# EAGLE schematic PICqueno32_DIP.v1 (EAGLE 5.11)
PROJECT: PICqueño32 DIP v1.0
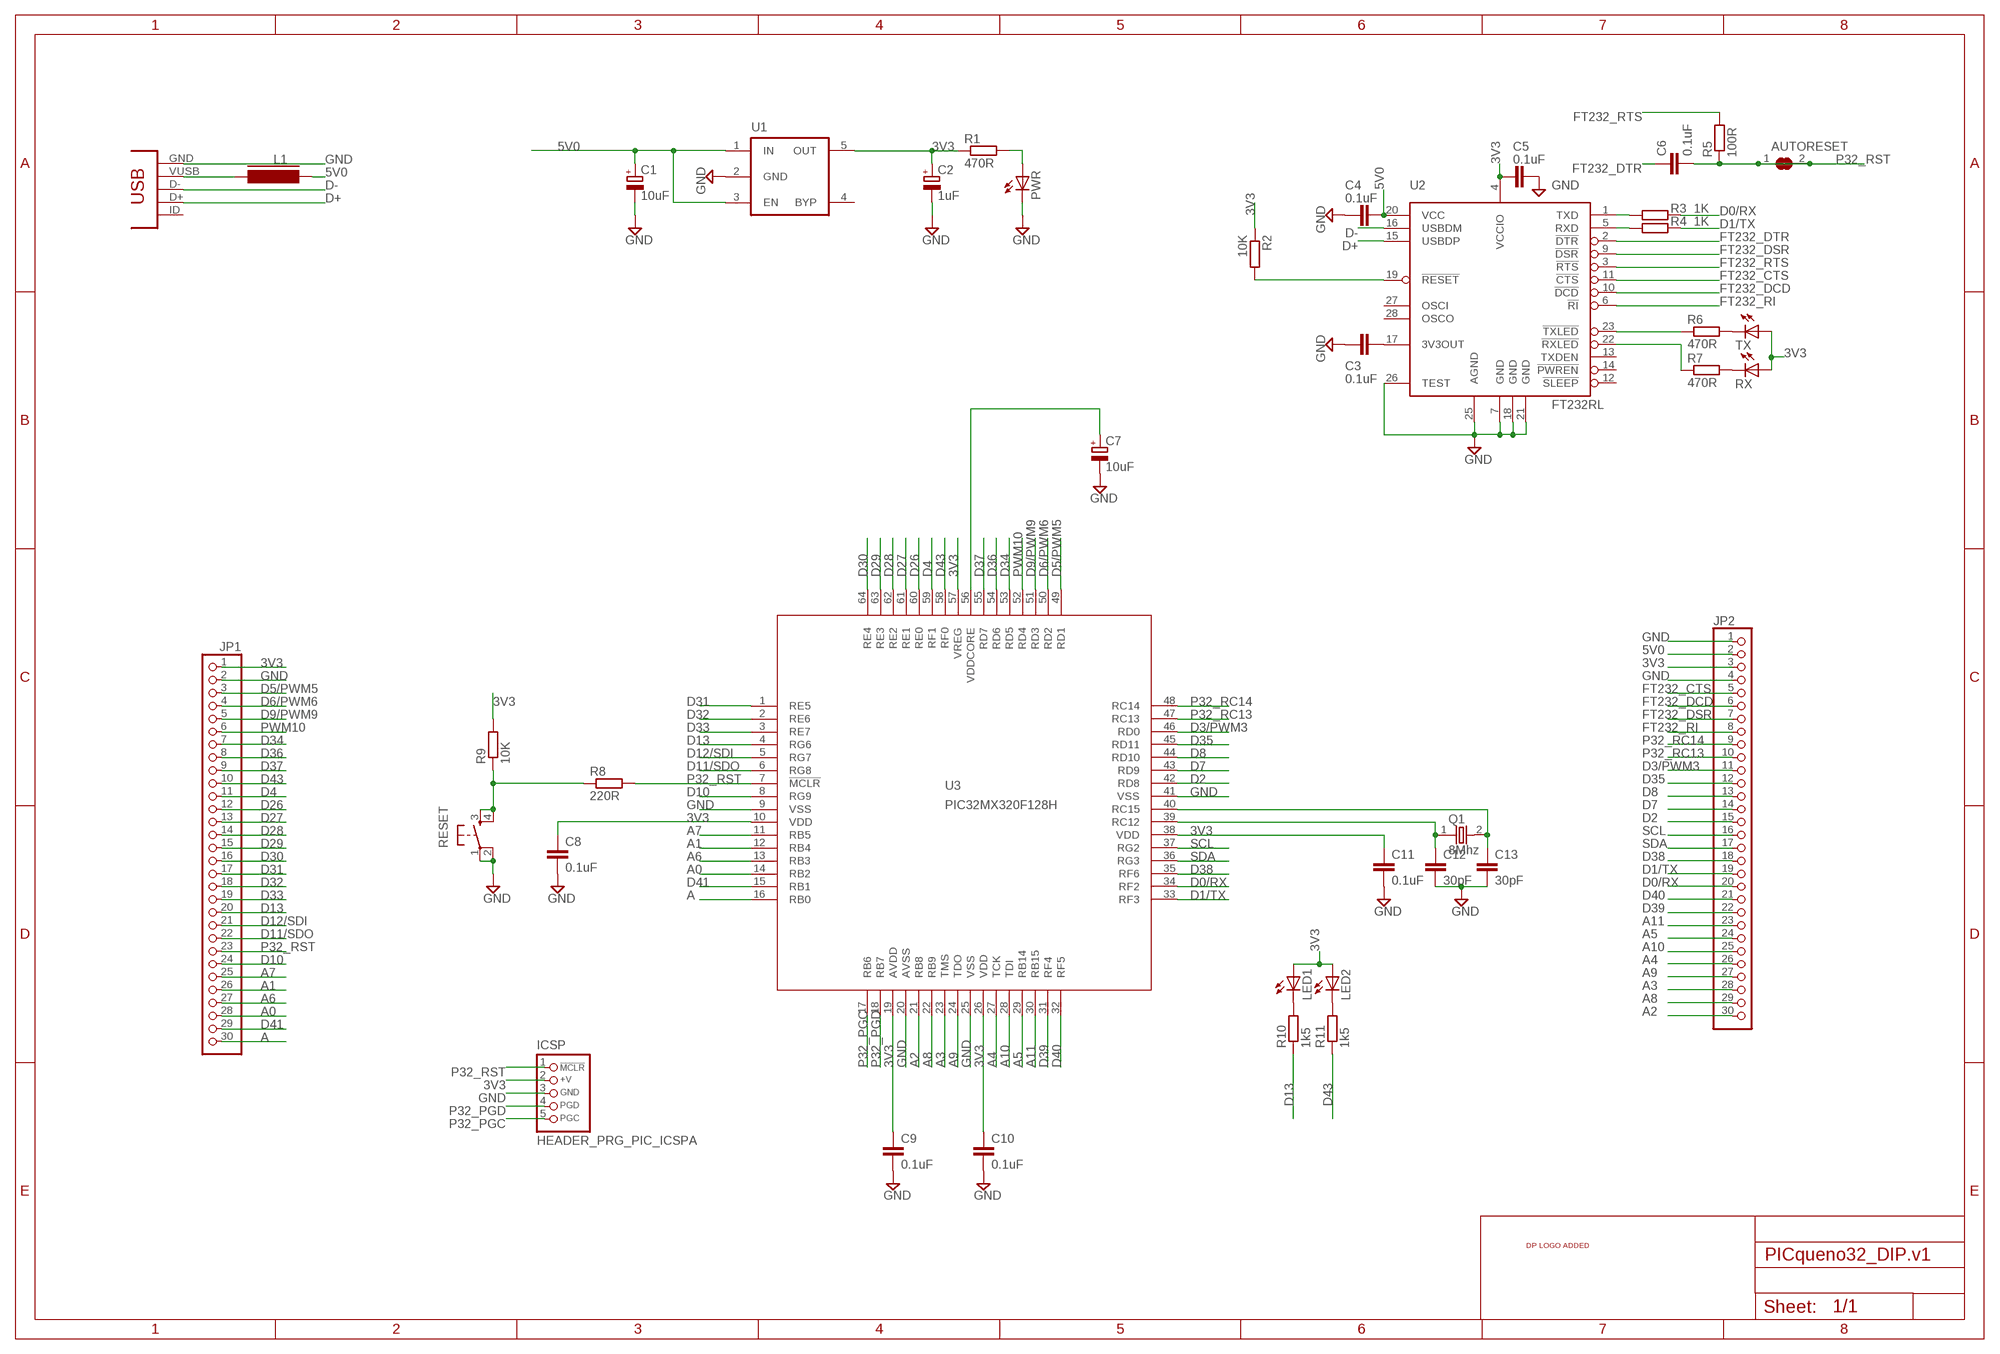
[diagram p0: schematic, sheet 1]

## Parts
AUTORESET  SJ  [SJ]
C1  10uF  CAP_POLSMC_A  [SMC_A]
C2  1uF  CAP_POLSMC_A  [SMC_A]
C3  0.1uF  CAPC603  [C603]
C4  0.1uF  CAPC603  [C603]
C5  0.1uF  CAPC603  [C603]
C6  0.1uF  CAPC603  [C603]
C7  10uF  CAP_POLSMC_A  [SMC_A]
C8  0.1uF  CAPC603  [C603]
C9  0.1uF  CAPC603  [C603]
C10  0.1uF  CAPC603  [C603]
C11  0.1uF  CAPC603  [C603]
C12  30pF  CAPC603  [C603]
C13  30pF  CAPC603  [C603]
ICSP  HEADER_PRG_PIC_ICSPA  [HEADER_PRG_1X05]
JP1  PINHD-1X30  [1X30]
JP2  PINHD-1X30  [1X30]
L1  FERRITE_BEAD603  [FB603]
LED1  LED805  [LED-805]
LED2  LED805  [LED-805]
PWR  LED805  [LED-805]
Q1  8Mhz  OSC-XTAL  [HC-49U]
R1  470R  RESISTORR603  [R603]
R2  10K  RESISTORR603  [R603]
R3  1K  RESISTORR603  [R603]
R4  1K  RESISTORR603  [R603]
R5  100R  RESISTORR603  [R603]
R6  470R  RESISTORR603  [R603]
R7  470R  RESISTORR603  [R603]
R8  220R  RESISTORR603  [R603]
R9  10K  RESISTORR603  [R603]
R10  1k5  RESISTORR603  [R603]
R11  1k5  RESISTORR603  [R603]
RESET  SW-SMD-SMALL  [TACT_SWITCH_SMALL]
RX  LED805  [LED-805]
TX  LED805  [LED-805]
U1  MIC5205  [SOT-23-5]
U2  FT232RL  [SSOP28]
U3  PIC32MX320F128H  PIC32MX320F064H  [TQFP64-10X10]
U$1  DP_LOGO  [DP_LOGO]
USB1  CON-USB-MINI-BUSB1  [CONN_USB_MINI-B]

## Nets
3V3: C2.+ C5.1 C8.1 C9.1 C10.1 C11.1 ICSP.2(+V) JP1.1 JP2.3 LED1.A LED2.A R1.1 R2.1 R9.2 RX.A TX.A U1.5(OUT) U2.4(VCCIO) U3.10(VDD) U3.19(AVDD) U3.26(VDD) U3.38(VDD) U3.57(VREG)
5V0: C1.+ C4.1 JP2.2 L1.1 U1.1(IN) U1.3(EN) U2.20(VCC)
A: JP1.30 U3.16(RB0)
A0: JP1.28 U3.14(RB2)
A1: JP1.26 U3.12(RB4)
A2: JP2.30 U3.21(RB8)
A3: JP2.28 U3.23(TMS)
A4: JP2.26 U3.27(TCK)
A5: JP2.24 U3.29(RB14)
A6: JP1.27 U3.13(RB3)
A7: JP1.25 U3.11(RB5)
A8: JP2.29 U3.22(RB9)
A9: JP2.27 U3.24(TDO)
A10: JP2.25 U3.28(TDI)
A11: JP2.23 U3.30(RB15)
D0/RX: JP2.20 R3.2 U3.34(RF2)
D1/TX: JP2.19 R4.2 U3.33(RF3)
D2: JP2.15 U3.42(RD8)
D3/PWM3: JP2.11 U3.46(RD0)
D4: JP1.11 U3.59(RF1)
D5/PWM5: JP1.3 U3.49(RD1)
D6/PWM6: JP1.4 U3.50(RD2)
D7: JP2.14 U3.43(RD9)
D8: JP2.13 U3.44(RD10)
D9/PWM9: JP1.5 U3.51(RD3)
D10: JP1.24 U3.8(RG9)
D11/SDO: JP1.22 U3.6(RG8)
D12/SDI: JP1.21 U3.5(RG7)
D13: JP1.20 R10.1 U3.4(RG6)
D26: JP1.12 U3.60(RE0)
D27: JP1.13 U3.61(RE1)
D28: JP1.14 U3.62(RE2)
D29: JP1.15 U3.63(RE3)
D30: JP1.16 U3.64(RE4)
D31: JP1.17 U3.1(RE5)
D32: JP1.18 U3.2(RE6)
D33: JP1.19 U3.3(RE7)
D34: JP1.7 U3.53(RD5)
D35: JP2.12 U3.45(RD11)
D36: JP1.8 U3.54(RD6)
D37: JP1.9 U3.55(RD7)
D38: JP2.18 U3.35(RF6)
D39: JP2.22 U3.31(RF4)
D40: JP2.21 U3.32(RF5)
D41: JP1.29 U3.15(RB1)
D43: JP1.10 R11.1 U3.58(RF0)
D+: U2.15(USBDP) USB1.D+
D-: U2.16(USBDM) USB1.D-
FT232_CTS: JP2.5 U2.11(!CTS)
FT232_DCD: JP2.6 U2.10(!DCD)
FT232_DSR: JP2.7 U2.9(!DSR)
FT232_DTR: C6.1 U2.2(!DTR)
FT232_RI: JP2.8 U2.6(!RI)
FT232_RTS: R5.2 U2.3(!RTS)
GND: C1.- C2.- C3.2 C4.2 C5.2 C7.- C8.2 C9.2 C10.2 C11.2 C12.2 C13.2 ICSP.3(GND) JP1.2 JP2.1 JP2.4 PWR.C RESET.1 RESET.2 U1.2(GND) U2.7(GND) U2.18(GND) U2.21(GND) U2.25(AGND) U2.26(TEST) U3.9(VSS) U3.20(AVSS) U3.25(VSS) U3.41(VSS) USB1.GND
N$1: C3.1 U2.17(3V3OUT)
N$2: R2.2 U2.19(!RESET)
N$3: R3.1 U2.1(TXD)
N$4: R4.1 U2.5(RXD)
N$5: C7.+ U3.56(VDDCORE)
N$6: R6.2 TX.C
N$8: LED1.C R10.2
N$9: LED2.C R11.2
N$11: R7.2 RX.C
N$12: R6.1 U2.23(!TXLED)
N$15: PWR.A R1.2
N$16: R8.1 R9.1 RESET.3 RESET.4
N$19: C12.1 Q1.1 U3.39(RC12)
N$20: C13.1 Q1.2 U3.40(RC15)
N$32: R7.1 U2.22(!RXLED)
P32_PGC: ICSP.5(PGC) U3.17(RB6)
P32_PGD: ICSP.4(PGD) U3.18(RB7)
P32_RC13: JP2.10 U3.47(RC13)
P32_RC14: JP2.9 U3.48(RC14)
P32_RST: AUTORESET.1 AUTORESET.2 C6.2 ICSP.1(/MCLR) JP1.23 R5.1 R8.2 U3.7(!MCLR)
PWM10: JP1.6 U3.52(RD4)
SCL: JP2.16 U3.37(RG2)
SDA: JP2.17 U3.36(RG3)
VUSB: L1.2 USB1.VUSB
Unconnected: U1.4(BYP) U2.12(!SLEEP) U2.13(TXDEN) U2.14(!PWREN) U2.27(OSCI) U2.28(OSCO) USB1.BODY@1(BODY) USB1.BODY@2(BODY) USB1.BODY@3(BODY) USB1.BODY@4(BODY) USB1.ID(USBID)

## Library data of the parts
AUTORESET = jumper:SJ: SMD solder JUMPER
C1 C2 C7 = dp_devices:CAP_POL
C3-C6 C8-C13 = dp_devices:CAP
ICSP = dp_devices:HEADER_PRG_PIC_ICSP: 5-pin PIC In Circuit Serial Programming header
JP1 JP2 = pinhead:PINHD-1X30: PIN HEADER
L1 = dp_devices:FERRITE_BEAD
LED1 LED2 PWR RX TX = dp_devices:LED
Q1 = dp_devices:OSC-XTAL
R1-R11 = dp_devices:RESISTOR
RESET = dp_devices:SW-SMD-SMALL
U1 = dp_devices:MIC5205: 150ma Low-Noise LDO Regulator
U2 = dp_devices:FT232RL: USB to serial UART interface
U3 = microchip:PIC32MX320F*H: PIC32MX320FxxxH Source: http://ww1.microchip.com/downloads/en/DeviceDoc/61143E.pdf, PIC32MX320F064H.bsdl; MPN: PIC32MX320F064H-80I/PT; OC_FARNELL: 1778934; OC_NEWARK: 77M3147
U$1 = dp_devices:DP_LOGO; FF1: fullfillment by; FF2: Seeed studio; FF3: www.seeedstudio.com; LICENSE: CC-BY-SA; PROJECT: project; URL1: http://; URL2: DangerousPrototypes.com
USB1 = dp_devices:CON-USB-MINI-B: USB connector